# EAGLE design DiveComputer_ButtonPanel (EAGLE 7.2.0)
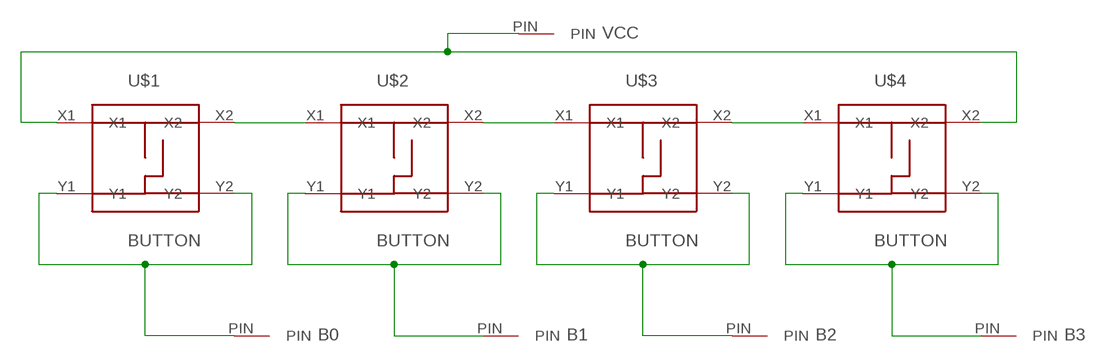
[diagram p0: schematic, sheet 1]

## Parts
B0  PIN  [PIN]
B1  PIN  [PIN]
B2  PIN  [PIN]
B3  PIN  [PIN]
U$1  BUTTON  [BUTTON]
U$2  BUTTON  [BUTTON]
U$3  BUTTON  [BUTTON]
U$4  BUTTON  [BUTTON]
VCC  PIN  [PIN]

## Nets
B0: B0.PIN U$1.Y1 U$1.Y2
B1: B1.PIN U$2.Y1 U$2.Y2
B2: B2.PIN U$3.Y1 U$3.Y2
B3: B3.PIN U$4.Y1 U$4.Y2
VCC: U$1.X1 U$1.X2 U$2.X1 U$2.X2 U$3.X1 U$3.X2 U$4.X1 U$4.X2 VCC.PIN

## Library data of the parts
B0 B1-B3 VCC = MySTM32F103RGT6:PIN
U$1-U$4 = My_STM32:BUTTON

## Board
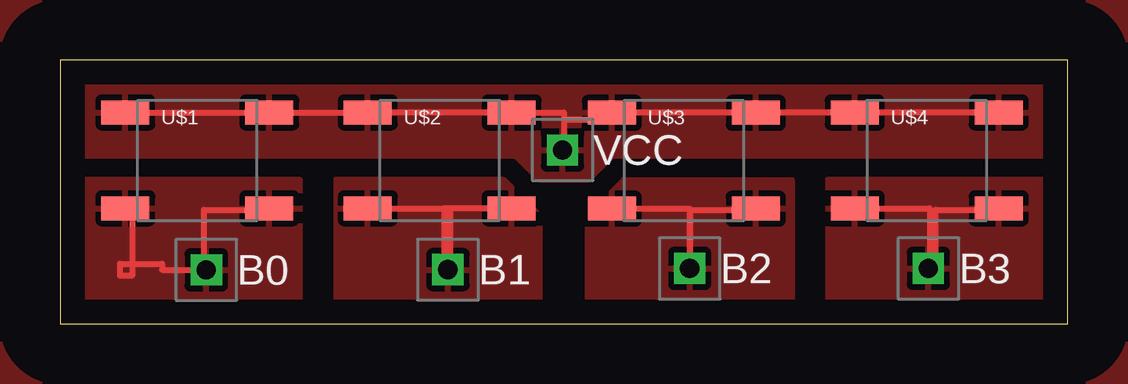
[diagram p1: board, top side]

Size 42 x 11 mm. Coordinates in mm from the lower left corner, seen from the top.
Outline: 0,0 42,0 42,11 0,11 0,0
Copper layers (1*16): Top 0.035mm / dielectric 1.5mm / Bottom 0.035mm
Design rules "default": minimum track width 10mil, minimum drill 24mil, track to track 8mil, track to pad 8mil, pad to pad 8mil, via to via 8mil, smd to smd 8mil, copper to edge 40mil, drill to drill 8mil, minimum pad ring 10mil, minimum via ring 8mil, stop-mask expansion 4mil, vias tented up to drill 0mil, thermal gap 10mil

### Footprints (pad centres in the part's own frame; a part is rotated, then mirrored left to right if it is on the bottom)
PIN = drill 0.8 square: PIN 0,0
BUTTON = smd 2 x 1: X1 -3,2; X2 3,2; Y1 -3,-2; Y2 3,-2

### Placement (x,y rotation side)
B0  6.1,2.24 0 top
B1  16.17,2.25 0 top
B2  26.25,2.3 0 top
B3  36.2,2.3 0 top
U$1  5.72,6.81 0 top
U$2  15.83,6.81 0 top
U$3  26,6.8 0 top
U$4  36.13,6.81 0 top
VCC  20.95,7.24 0 top

### Tracks (layer width: path | path; a pad name or v marks a point on that pad's centre or on a via)
B0
  Top 0.254: U$1.Y1 3,4.81 3,2.5 | 3,2.5 3,2 2.5,2 2.5,2.5 3,2.5 | 6,2.25 6,4.75 8.75,4.75 | 8.75,4.75 9.5,4.75 9.5,5 8.75,5 8.75,4.81 | 3,2.5 4.25,2.5 4.25,2.25 6,2.25 | B0.PIN 6,2.24 6,2.25 | U$1.Y2 8.75,4.81 | 8.75,4.81 8.75,4.75
  pour Top: 0.5,6 0.5,0.5 10,0.5 10,6
B1
  Top 0.254: U$2.Y2 16,4.81 16,2.5 16.25,2.5 | U$2.Y1 16.25,4.81 16.25,2.5 | 16.25,2.5 16.25,2.25 B1.PIN
  pour Top: 11.5,6 11.5,0.5 20,0.5 20,4.5 18.5,6
B2
  Top 0.254: B2.PIN 26.25,4.75 29,4.75 | 29,4.75 29.5,4.75 29.5,5 29,5 U$3.Y2 29,4.75 | U$3.Y1 26.25,4.8 26.25,2.25
  pour Top: 22,0.5 22,4.5 23.5,6 30.5,6 30.5,0.5
B3
  Top 0.254: U$4.Y1 36.25,4.81 36.25,2.3 | U$4.Y2 39.25,4.81 39.25,4.75 36.5,4.75 36.5,2.3 B3.PIN 36.25,2.3 | 36.25,2.3 36.25,2.25
  pour Top: 32,6 32,0.5 41.5,0.5 41.5,6
GND
  pour Top (isolate 2.54): -7,-7 194,-7 194,281 -7,281
VCC
  Top 0.254: U$1.X1 U$1.X2 | U$1.X2 9,8.81 9,9 8.5,9 | U$1.X2 U$2.X1 13,8.81 | 13,8.81 U$2.X2 21,8.81 21,8.5 | 13,8.81 13,8.5 12.5,8.5 12.5,9 13,9 13,8.81 | U$4.X2 U$4.X1 | U$4.X1 U$3.X2 | U$3.X2 29,9 | U$3.X1 U$3.X2 | U$3.X1 23,9 | U$3.X1 22.5,8.8 22.5,8.5 21,8.5 | 21,8.5 21,7.25 21,7.24 | 23,8.5 U$3.X1 | 21,7 21,7.24 | U$4.X1 33,8.81 33,9 | VCC.PIN 21,7.24
  pour Top: 0.5,10.5 41.5,10.5 41.5,7 23,7 22,6 20,6 19,7 0.5,7